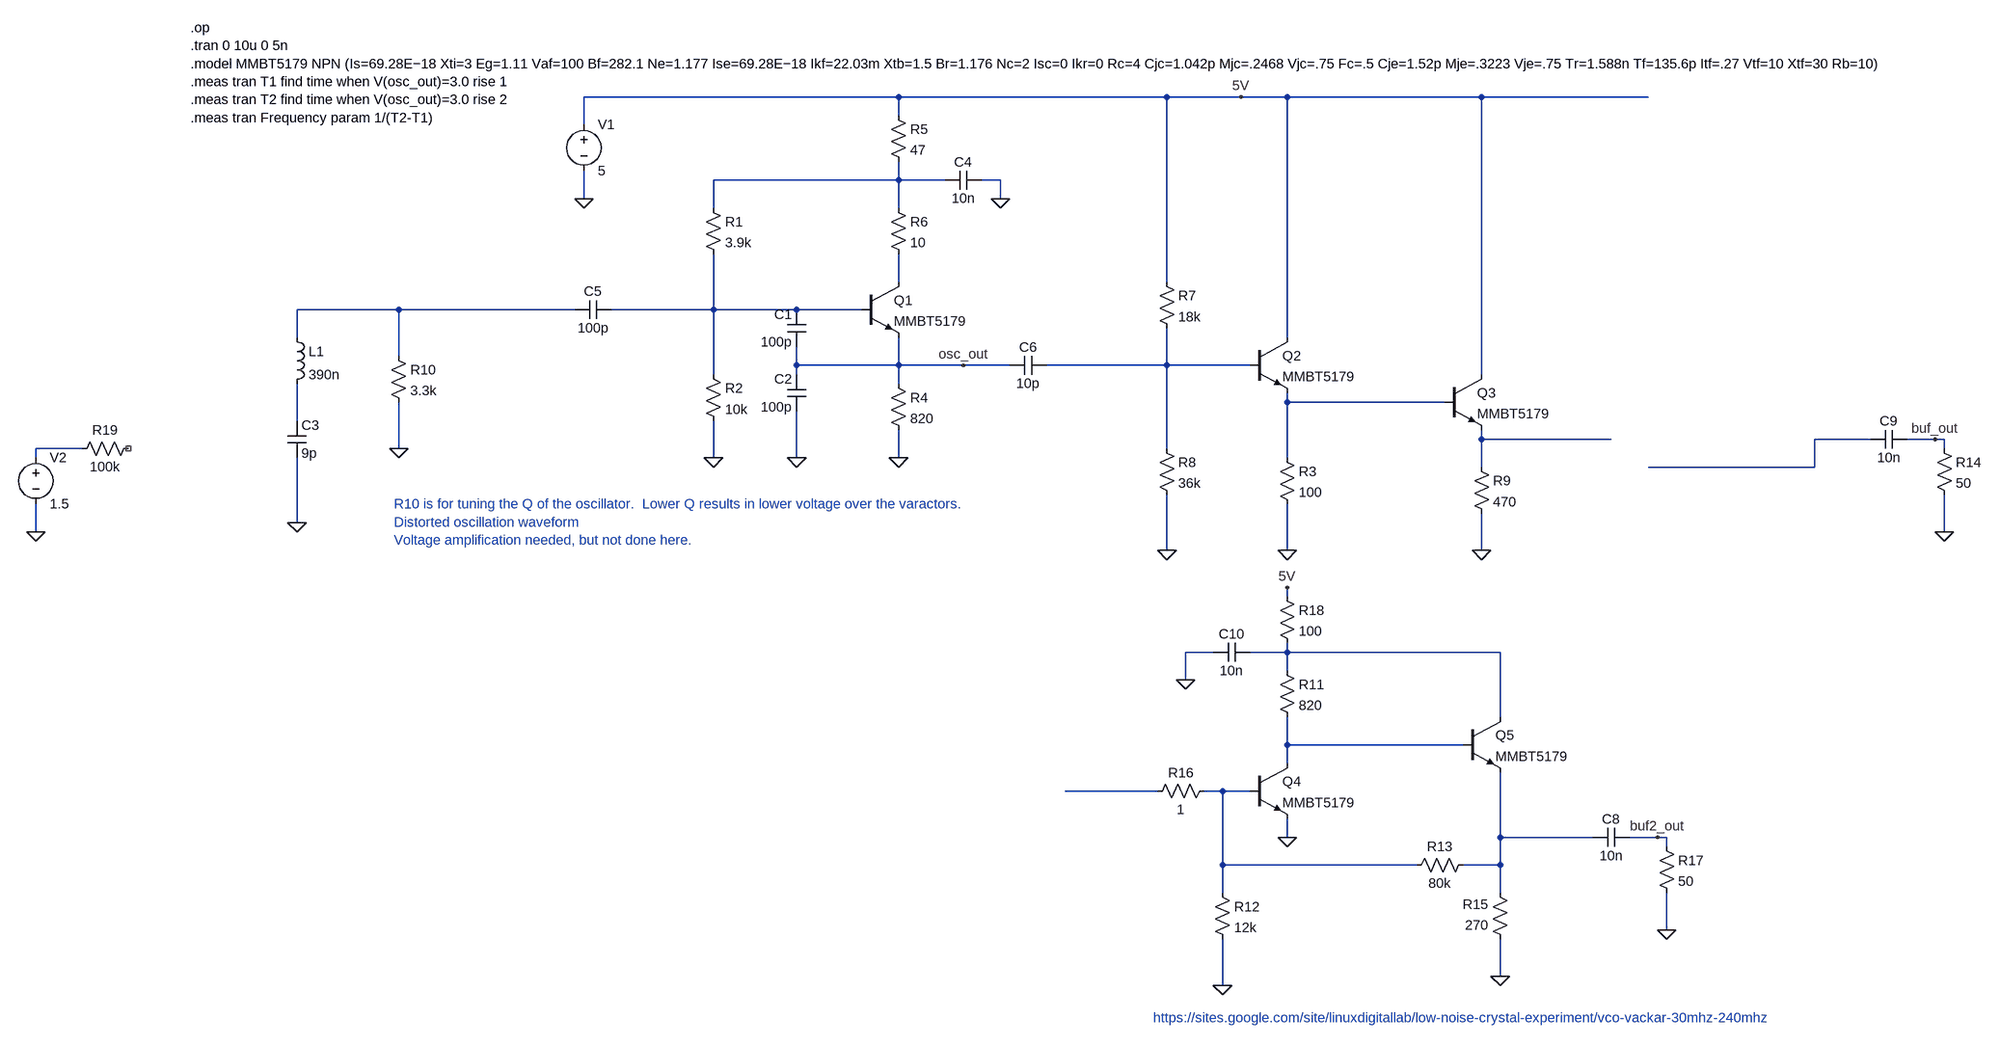
[diagram p0: schematic CC_Clapp_design1.asc]
CC_Clapp_design1.asc, the LTspice schematic file:
Version 4
SHEET 1 2200 2152
WIRE -624 544 -1168 544
WIRE -160 544 -624 544
WIRE -32 544 -160 544
WIRE 48 544 -32 544
WIRE 384 544 48 544
WIRE 672 544 384 544
WIRE -624 576 -624 544
WIRE -1168 592 -1168 544
WIRE -624 688 -624 656
WIRE -624 688 -944 688
WIRE -544 688 -624 688
WIRE -448 688 -480 688
WIRE -1168 720 -1168 672
WIRE -448 720 -448 688
WIRE -944 736 -944 688
WIRE -624 736 -624 688
WIRE -624 864 -624 816
WIRE -160 864 -160 544
WIRE -1488 912 -1664 912
WIRE -1184 912 -1488 912
WIRE -944 912 -944 816
WIRE -944 912 -1120 912
WIRE -800 912 -944 912
WIRE -688 912 -800 912
WIRE -1664 960 -1664 912
WIRE 48 960 48 544
WIRE -1488 992 -1488 912
WIRE -800 1008 -800 976
WIRE -624 1008 -624 960
WIRE -624 1008 -800 1008
WIRE -512 1008 -624 1008
WIRE -432 1008 -512 1008
WIRE -160 1008 -160 944
WIRE -160 1008 -368 1008
WIRE -16 1008 -160 1008
WIRE -944 1024 -944 912
WIRE -800 1024 -800 1008
WIRE 384 1024 384 544
WIRE -624 1040 -624 1008
WIRE 48 1072 48 1056
WIRE 320 1072 48 1072
WIRE -1664 1104 -1664 1040
WIRE 384 1136 384 1120
WIRE 608 1136 384 1136
WIRE 1056 1136 960 1136
WIRE 1168 1136 1120 1136
WIRE 1184 1136 1168 1136
WIRE -2112 1152 -2192 1152
WIRE -1488 1152 -1488 1072
WIRE -160 1152 -160 1008
WIRE 1184 1152 1184 1136
WIRE -2192 1168 -2192 1152
WIRE -944 1168 -944 1104
WIRE -800 1168 -800 1088
WIRE -624 1168 -624 1120
WIRE 48 1168 48 1072
WIRE 384 1184 384 1136
WIRE 960 1184 960 1136
WIRE 960 1184 672 1184
WIRE -1664 1280 -1664 1168
WIRE -2192 1296 -2192 1248
WIRE 1184 1296 1184 1232
WIRE -160 1328 -160 1232
WIRE 48 1328 48 1248
WIRE 384 1328 384 1264
WIRE 48 1408 48 1392
WIRE -80 1504 -128 1504
WIRE 48 1504 48 1488
WIRE 48 1504 -16 1504
WIRE 416 1504 48 1504
WIRE 48 1536 48 1504
WIRE -128 1552 -128 1504
WIRE 416 1616 416 1504
WIRE 48 1664 48 1616
WIRE 352 1664 48 1664
WIRE 48 1696 48 1664
WIRE -176 1744 -336 1744
WIRE -64 1744 -96 1744
WIRE -16 1744 -64 1744
WIRE 48 1824 48 1792
WIRE 416 1824 416 1712
WIRE 576 1824 416 1824
WIRE 688 1824 640 1824
WIRE 704 1824 688 1824
WIRE 704 1840 704 1824
WIRE -64 1872 -64 1744
WIRE 272 1872 -64 1872
WIRE 416 1872 416 1824
WIRE 416 1872 352 1872
WIRE -64 1920 -64 1872
WIRE 416 1920 416 1872
WIRE 704 1984 704 1920
WIRE 416 2064 416 2000
WIRE -64 2080 -64 2000
FLAG -1168 720 0
FLAG -944 1168 0
FLAG -800 1168 0
FLAG -624 1168 0
FLAG -448 720 0
FLAG -512 1008 osc_out
FLAG 48 1328 0
FLAG 1184 1296 0
FLAG 1168 1136 buf_out
FLAG -64 2080 0
FLAG 416 2064 0
FLAG -32 544 5V
FLAG 48 1392 5V
FLAG 704 1984 0
FLAG 688 1824 buf2_out
FLAG 48 1824 0
FLAG -128 1552 0
FLAG -2192 1296 0
FLAG 384 1328 0
FLAG -1664 1280 0
FLAG -160 1328 0
FLAG -1488 1152 0
DATAFLAG -1040 912 ""
DATAFLAG -704 1008 ""
DATAFLAG -832 688 ""
DATAFLAG 144 1664 ""
DATAFLAG 160 1872 ""
DATAFLAG -256 1008 ""
DATAFLAG 48 1104 ""
DATAFLAG 496 1136 ""
SYMBOL voltage -1168 576 R0
SYMATTR InstName V1
SYMATTR Value 5
SYMBOL res -960 720 R0
SYMATTR InstName R1
SYMATTR Value 3.9k
SYMBOL res -960 1008 R0
SYMATTR InstName R2
SYMATTR Value 10k
SYMBOL res -640 1024 R0
SYMATTR InstName R4
SYMATTR Value 820
SYMBOL res -640 560 R0
SYMATTR InstName R5
SYMATTR Value 47
SYMBOL cap -480 672 R90
WINDOW 0 0 32 VBottom 2
WINDOW 3 32 32 VTop 2
SYMATTR InstName C4
SYMATTR Value 10n
SYMBOL cap -784 976 R180
WINDOW 0 24 56 Left 2
WINDOW 3 24 8 Left 2
SYMATTR InstName C1
SYMATTR Value 100p
SYMBOL cap -784 1088 R180
WINDOW 0 24 56 Left 2
WINDOW 3 24 8 Left 2
SYMATTR InstName C2
SYMATTR Value 100p
SYMBOL ind -1680 944 R0
SYMATTR InstName L1
SYMATTR Value 390n
SYMATTR SpiceLine Rser=1.17
SYMBOL npn -688 864 R0
SYMATTR InstName Q1
SYMATTR Value MMBT5179
SYMBOL npn -16 960 R0
SYMATTR InstName Q2
SYMATTR Value MMBT5179
SYMBOL res 32 1152 R0
SYMATTR InstName R3
SYMATTR Value 100
SYMBOL cap -368 992 R90
WINDOW 0 0 32 VBottom 2
WINDOW 3 32 32 VTop 2
SYMATTR InstName C6
SYMATTR Value 10p
SYMBOL res -176 848 R0
SYMATTR InstName R7
SYMATTR Value 18k
SYMBOL cap 1120 1120 R90
WINDOW 0 0 32 VBottom 2
WINDOW 3 32 32 VTop 2
SYMATTR InstName C9
SYMATTR Value 10n
SYMBOL res 1168 1136 R0
SYMATTR InstName R14
SYMATTR Value 50
SYMBOL res -640 720 R0
SYMATTR InstName R6
SYMATTR Value 10
SYMBOL cap -1120 896 R90
WINDOW 0 0 32 VBottom 2
WINDOW 3 32 32 VTop 2
SYMATTR InstName C5
SYMATTR Value 100p
SYMBOL npn -16 1696 R0
SYMATTR InstName Q4
SYMATTR Value MMBT5179
SYMBOL npn 352 1616 R0
SYMATTR InstName Q5
SYMATTR Value MMBT5179
SYMBOL res 32 1520 R0
SYMATTR InstName R11
SYMATTR Value 820
SYMBOL res -80 1904 R0
SYMATTR InstName R12
SYMATTR Value 12k
SYMBOL res 368 1856 R90
WINDOW 0 0 56 VBottom 2
WINDOW 3 32 56 VTop 2
SYMATTR InstName R13
SYMATTR Value 80k
SYMBOL res 432 2016 R180
WINDOW 0 36 76 Left 2
WINDOW 3 36 40 Left 2
SYMATTR InstName R15
SYMATTR Value 270
SYMBOL res -80 1728 R90
WINDOW 0 0 56 VBottom 2
WINDOW 3 32 56 VTop 2
SYMATTR InstName R16
SYMATTR Value 1
SYMBOL cap 640 1808 R90
WINDOW 0 0 32 VBottom 2
WINDOW 3 32 32 VTop 2
SYMATTR InstName C8
SYMATTR Value 10n
SYMBOL res 688 1824 R0
SYMATTR InstName R17
SYMATTR Value 50
SYMBOL res 32 1392 R0
SYMATTR InstName R18
SYMATTR Value 100
SYMBOL cap -16 1488 R90
WINDOW 0 0 32 VBottom 2
WINDOW 3 32 32 VTop 2
SYMATTR InstName C10
SYMATTR Value 10n
SYMBOL res -2016 1136 R90
WINDOW 0 0 56 VBottom 2
WINDOW 3 32 56 VTop 2
SYMATTR InstName R19
SYMATTR Value 100k
SYMBOL voltage -2192 1152 R0
WINDOW 123 0 0 Left 0
WINDOW 39 0 0 Left 0
SYMATTR InstName V2
SYMATTR Value 1.5
SYMBOL npn 320 1024 R0
SYMATTR InstName Q3
SYMATTR Value MMBT5179
SYMBOL res 368 1168 R0
SYMATTR InstName R9
SYMATTR Value 470
SYMBOL res -176 1136 R0
SYMATTR InstName R8
SYMATTR Value 36k
SYMBOL res -1504 976 R0
SYMATTR InstName R10
SYMATTR Value 3.3k
SYMBOL cap -1680 1104 R0
SYMATTR InstName C3
SYMATTR Value 9p
TEXT -1848 424 Left 2 !.op\n.tran 0 10u 0 5n\n.model MMBT5179 NPN (Is=69.28E−18 Xti=3 Eg=1.11 Vaf=100 Bf=282.1 Ne=1.177 Ise=69.28E−18 Ikf=22.03m Xtb=1.5 Br=1.176 Nc=2 Isc=0 Ikr=0 Rc=4 Cjc=1.042p Mjc=.2468 Vjc=.75 Fc=.5 Cje=1.52p Mje=.3223 Vje=.75 Tr=1.588n Tf=135.6p Itf=.27 Vtf=10 Xtf=30 Rb=10)\n.meas tran T1 find time when V(osc_out)=3.0 rise 1\n.meas tran T2 find time when V(osc_out)=3.0 rise 2\n.meas tran Frequency param 1/(T2-T1)
TEXT -184 2136 Left 2 ;https://sites.google.com/site/linuxdigitallab/low-noise-crystal-experiment/vco-vackar-30mhz-240mhz
TEXT -1496 1248 Left 2 ;R10 is for tuning the Q of the oscillator.  Lower Q results in lower voltage over the varactors.\nDistorted oscillation waveform\nVoltage amplification needed, but not done here.

The netlist it stands for:
* CC_Clapp_design1.asc
V1 5V 0 5
R1 N001 N004 3.9k
R2 N004 0 10k
R4 osc_out 0 820
R5 5V N001 47
C4 0 N001 10n
C1 osc_out N004 100p
C2 0 osc_out 100p
L1 N003 N007 390n Rser=1.17
Q1 N002 N004 osc_out 0 MMBT5179
Q2 5V N005 N006 0 MMBT5179
R3 N006 0 100
C6 N005 osc_out 10p
R7 5V N005 18k
C9 buf_out N009 10n
R14 buf_out 0 50
R6 N001 N002 10
C5 N004 N003 100p
Q4 N012 N014 0 0 MMBT5179
Q5 N011 N012 N015 0 MMBT5179
R11 N011 N012 820
R12 N014 0 12k
R13 N015 N014 80k
R15 0 N015 270
R16 N014 N013 1
C8 buf2_out N015 10n
R17 buf2_out 0 50
R18 5V N011 100
C10 N011 0 10n
R19 NC_01 N010 100k
V2 N010 0 1.5
Q3 5V N006 N008 0 MMBT5179
R9 N008 0 470
R8 N005 0 36k
R10 N003 0 3.3k
C3 N007 0 9p
.model NPN NPN
.model PNP PNP
.lib standard.bjt
.op
.tran 0 10u 0 5n
.model MMBT5179 NPN (Is=69.28E−18 Xti=3 Eg=1.11 Vaf=100 Bf=282.1 Ne=1.177 Ise=69.28E−18 Ikf=22.03m Xtb=1.5 Br=1.176 Nc=2 Isc=0 Ikr=0 Rc=4 Cjc=1.042p Mjc=.2468 Vjc=.75 Fc=.5 Cje=1.52p Mje=.3223 Vje=.75 Tr=1.588n Tf=135.6p Itf=.27 Vtf=10 Xtf=30 Rb=10)
.meas tran T1 find time when V(osc_out)=3.0 rise 1
.meas tran T2 find time when V(osc_out)=3.0 rise 2
.meas tran Frequency param 1/(T2-T1)
* https://sites.google.com/site/linuxdigitallab/low-noise-crystal-experiment/vco-vackar-30mhz-240mhz
* R10 is for tuning the Q of the oscillator.  Lower Q results in lower voltage over the varactors.
* Distorted oscillation waveform
* Voltage amplification needed, but not done here.
.backanno
.end